# EAGLE design PhD_HAT (EAGLE 9.5.0)

## Sheet 1 of 2
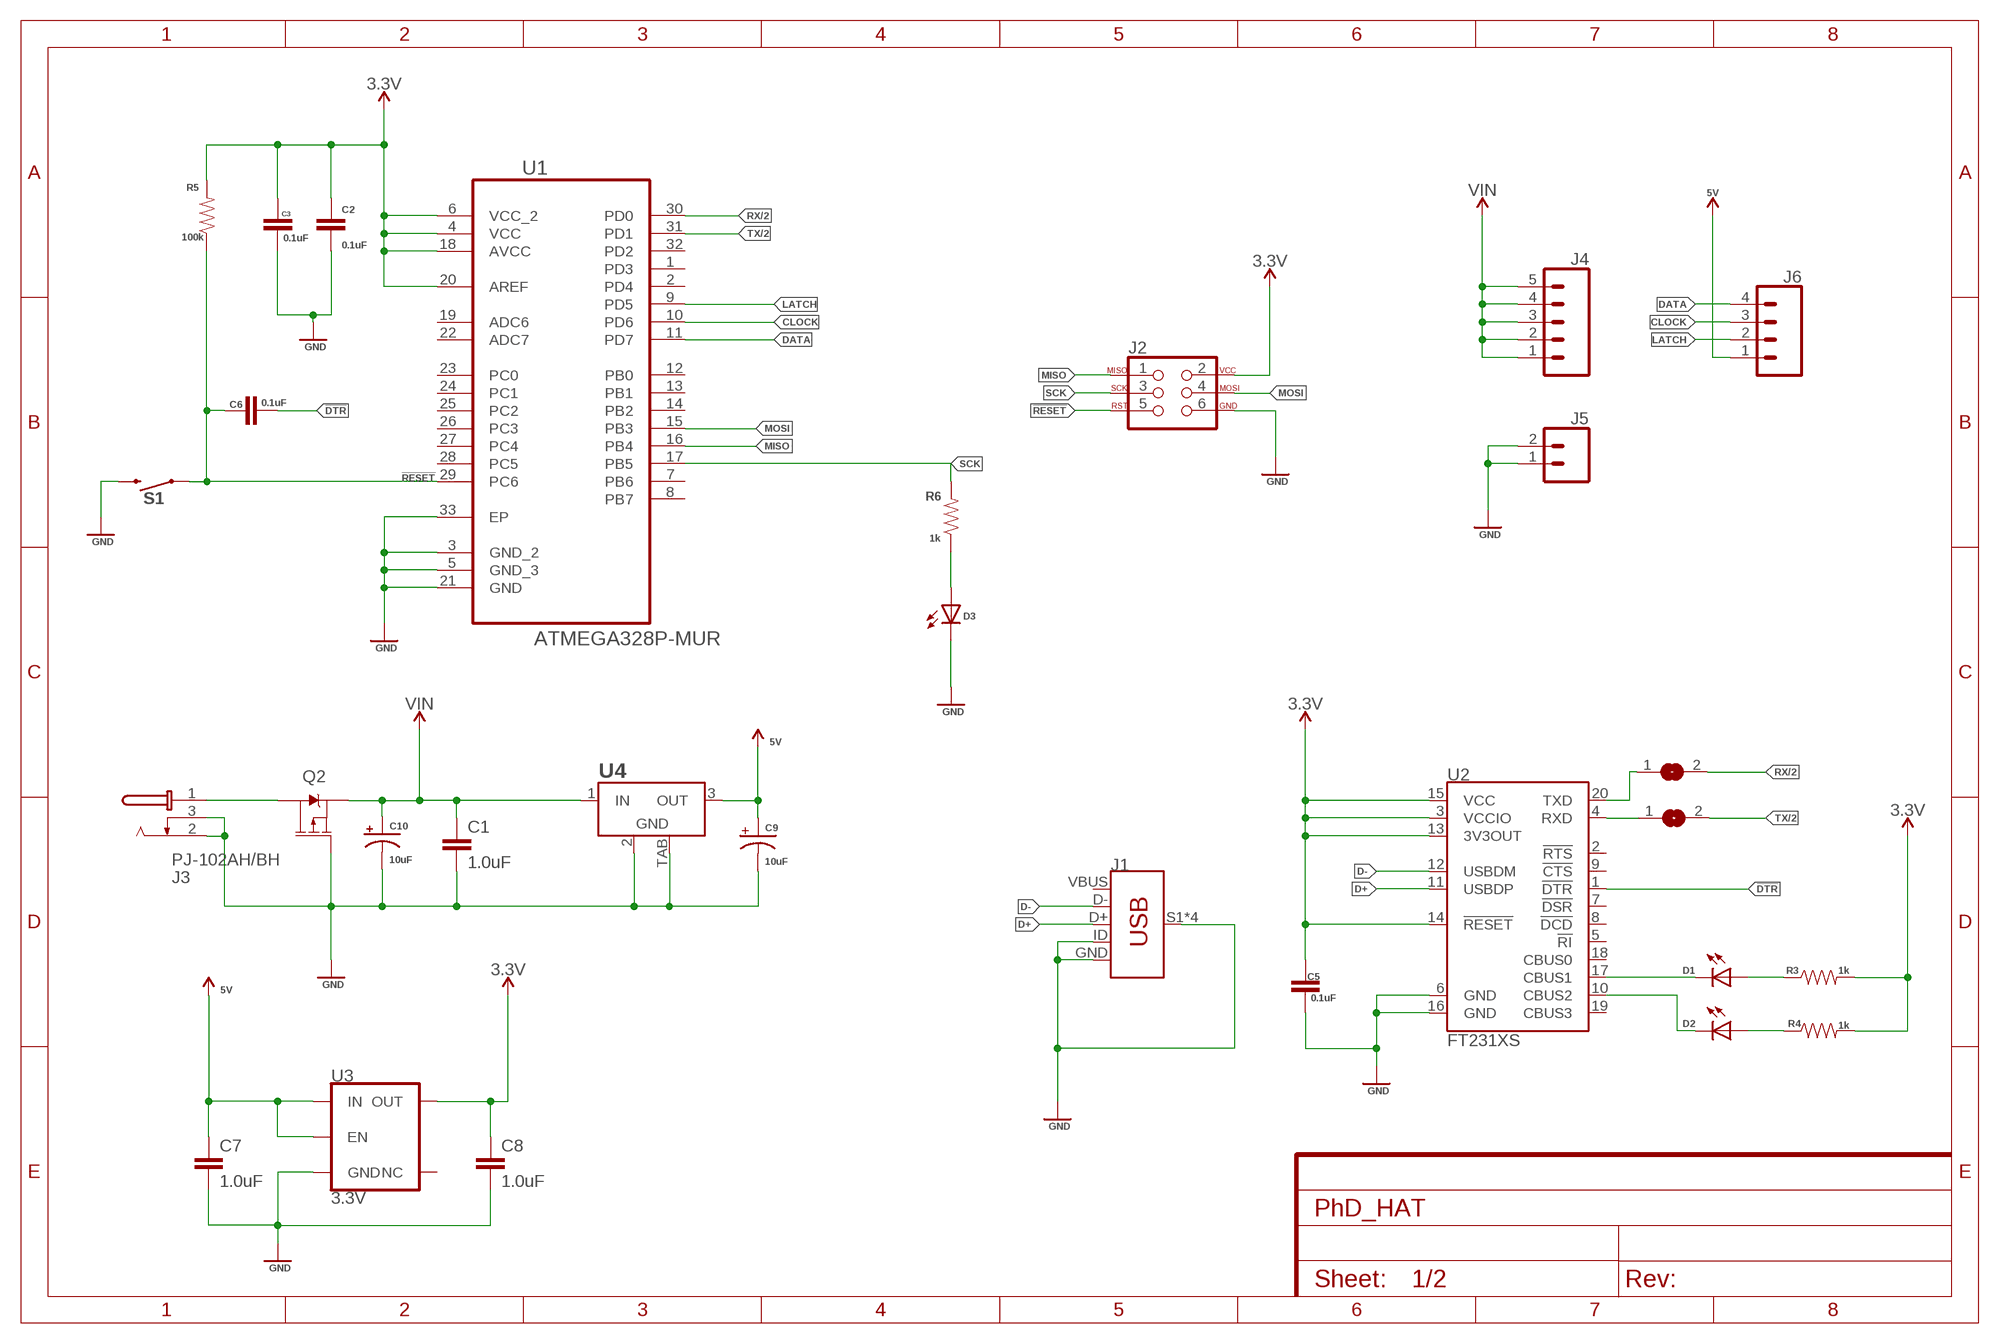
[diagram p0: schematic, sheet 1]

### Parts
C1  1.0uF  1.0UF-0603-16V-10%  [0603]
C2  0.1uF  0.1UF-0603-25V-(+80/-20%)  [0603]
C3  0.1uF  0.1UF-0603-25V-(+80/-20%)  [0603]
C5  0.1uF  0.1UF-0603-25V-(+80/-20%)  [0603]
C6  0.1uF  0.1UF-0603-25V-(+80/-20%)  [0603]
C7  1.0uF  1.0UF-0603-16V-10%  [0603]
C8  1.0uF  1.0UF-0603-16V-10%  [0603]
C9  10uF  10UF-POLAR-EIA3216-16V-10%(TANT)  [EIA3216]
C10  10uF  10UF-POLAR-EIA3216-16V-10%(TANT)  [EIA3216]
D1  LEDCHIP-LED0603  [CHIP-LED0603]
D2  LEDCHIP-LED0603  [CHIP-LED0603]
D3  LEDCHIP-LED0603  [CHIP-LED0603]
J1  USB_MINI-B_SMT  [USB-MINIB]
J2  AVR_SPI_PROG_3X2PTH  [2X3]
J3  PJ-102AH/BH  [PJ-102XH]
J4  CONN_05SCREW  [SCREWTERMINAL-3.5MM-5]
J5  CONN_023.5MM  [SCREWTERMINAL-3.5MM-2]
J6  CONN_04SCREW  [SCREWTERMINAL-3.5MM-4]
Q2  2.5A/30V/105mΩ  MOSFET_PCH-DMG2307L  [SOT23-3]
R3  1k  1KOHM-0603-1/10W-1%  [0603]
R4  1k  1KOHM-0603-1/10W-1%  [0603]
R5  100k  100KOHM-0603-1/10W-1%  [0603]
R6  1k  1KOHM-0603-1/10W-1%  [0603]
S1  MOMENTARY-SWITCH-SPST-PTH-6.0MM  [TACTILE_SWITCH_PTH_6.0MM]
SJ1  MICROBUILDER_SOLDERJUMPERREFLOW  [MICROBUILDER_SOLDERJUMPER_REFLOW]
SJ2  MICROBUILDER_SOLDERJUMPERREFLOW  [MICROBUILDER_SOLDERJUMPER_REFLOW]
U1  ATMEGA328P-MUR  [QFN50P500X500X100-33N]
U2  FT231XS  [SSOP20_L]
U3  3.3V  V_REG_AP2112K-3.3V  [SOT23-5]
U4  MIC39100-5.0WS  [SOT223]

### Nets
3.3V: C2.1 C3.1 C5.1 C8.1 J2.2 R3.2 R4.2 R5.2 U1.4(VCC) U1.6(VCC_2) U1.18(AVCC) U1.20(AREF) U2.3(VCCIO) U2.13(3V3OUT) U2.14(!RESET) U2.15(VCC) U3.5(OUT)
5V: C7.1 C9.+ J6.1 U3.1(IN) U3.3(EN) U4.3(OUT)
!DTR: C6.2 U2.1(!DTR)
!RESET: C6.1 J2.5 R5.1 S1.1 U1.29(PC6)
CLOCK: J6.3 U1.10(PD6)
D+: J1.D+ U2.11(USBDP)
D-: J1.D- U2.12(USBDM)
DATA: J6.4 U1.11(PD7)
GND: C1.2 C2.2 C3.2 C5.2 C7.2 C8.2 C9.- C10.- D3.C J1.GND J1.ID J1.S1(SHIELD) J1.S2(SHIELD) J1.S3(SHIELD) J1.S4(SHIELD) J2.6 J3.2(S) J3.3(SS) J5.1 J5.2 Q2.1(G) S1.3 U1.3(GND_2) U1.5(GND_3) U1.21(GND) U1.33(EP) U2.6(GND) U2.16(GND) U3.2(GND) U4.2(GND) U4.TAB(GND) ; also sheet 2
LATCH: J6.2 U1.9(PD5)
MISO: J2.1 U1.16(PB4)
MOSI: J2.4 U1.15(PB3)
N$2: D1.C U2.17(CBUS1)
N$3: D2.C U2.10(CBUS2)
N$4: D1.A R3.1
N$5: D2.A R4.1
N$6: D3.A R6.1
N$7: SJ1.1 U2.4(RXD)
N$8: SJ2.1 U2.20(TXD)
N$9: J3.1(T) Q2.3(D)
RX: SJ2.2 U1.30(PD0) ; also sheet 2
SCK: J2.3 R6.2 U1.17(PB5)
TX: SJ1.2 U1.31(PD1) ; also sheet 2
VIN: C1.1 C10.+ J4.1 J4.2 J4.3 J4.4 J4.5 Q2.2(S) U4.1(IN)
Unconnected: U1.1(PD3) U1.2(PD4) U1.7(PB6) U1.8(PB7) U1.12(PB0) U1.13(PB1) U1.14(PB2) U1.19(ADC6) U1.22(ADC7) U1.23(PC0) U1.24(PC1) U1.25(PC2) U1.26(PC3) U1.27(PC4) U1.28(PC5) U1.32(PD2) U2.2(!RTS) U2.5(!RI) U2.7(!DSR) U2.8(!DCD) U2.9(!CTS) U2.18(CBUS0) U2.19(CBUS3) U3.4(NC)

## Sheet 2 of 2
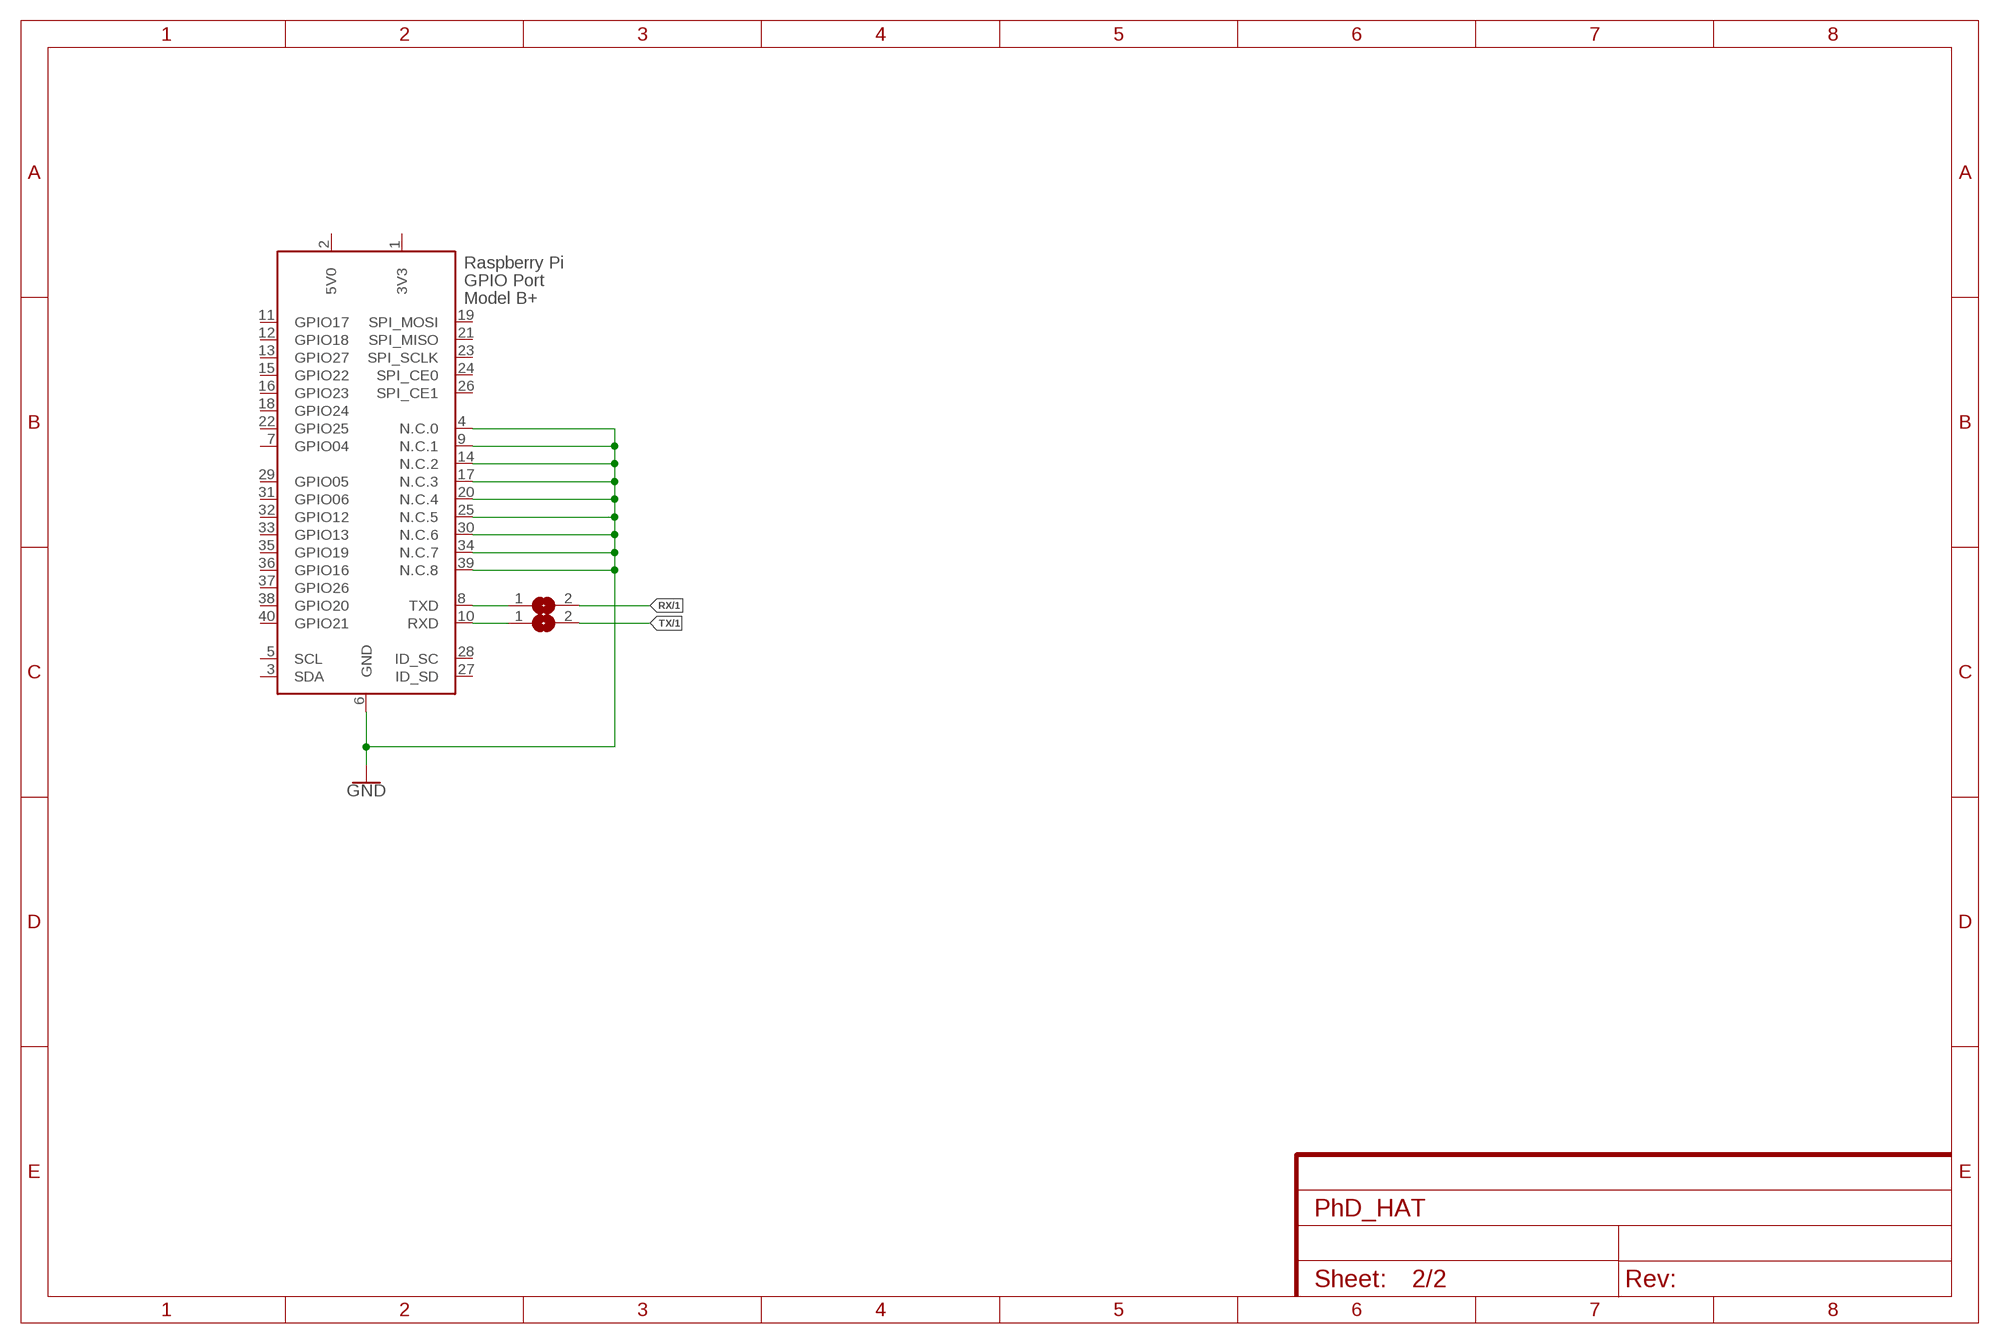
[diagram p1: schematic, sheet 2]

### Parts
SJ3  MICROBUILDER_SOLDERJUMPER  [MICROBUILDER_SOLDERJUMPER_ARROW_NOPASTE]
SJ4  MICROBUILDER_SOLDERJUMPER  [MICROBUILDER_SOLDERJUMPER_ARROW_NOPASTE]
X1  RASPI_BOARD_B+_H  [RASPI_BOARD_B+HAT]

### Nets
GND: X1.4(N.C.0) X1.6(GND) X1.9(N.C.1) X1.14(N.C.2) X1.17(N.C.3) X1.20(N.C.4) X1.25(N.C.5) X1.30(N.C.6) X1.34(N.C.7) X1.39(N.C.8) ; also sheet 1
N$11: SJ3.1 X1.8(TXD)
N$12: SJ4.1 X1.10(RXD)
RX: SJ3.2 ; also sheet 1
TX: SJ4.2 ; also sheet 1
Unconnected: X1.3(SDA) X1.5(SCL) X1.7(GPIO04) X1.11(GPIO17) X1.12(GPIO18) X1.13(GPIO27) X1.15(GPIO22) X1.16(GPIO23) X1.18(GPIO24) X1.19(SPI_MOSI) X1.21(SPI_MISO) X1.22(GPIO25) X1.23(SPI_SCLK) X1.24(SPI_CE0) X1.26(SPI_CE1) X1.27(ID_SD) X1.28(ID_SC) X1.29(GPIO05) X1.31(GPIO06) X1.32(GPIO12) X1.33(GPIO13) X1.35(GPIO19) X1.36(GPIO16) X1.37(GPIO26) X1.38(GPIO20) X1.40(GPIO21)

## Power pins joined to a net without a drawn wire
3V3: X1.1(3V3)
5V0: X1.2(5V0)
VBUS: J1.VBUS

## Library data of the parts
C1 C7 C8 = SparkFun-Capacitors:1.0UF: 1µF ceramic capacitors A capacitor is a passive two-terminal electrical component used to store electrical energy temporarily in an electric field.; PROD_ID: CAP-00868
C2 C3 C5 C6 = SparkFun-Capacitors:0.1UF: 0.1µF ceramic capacitors A capacitor is a passive two-terminal electrical component used to store electrical energy temporarily in an electric field.; PROD_ID: CAP-00810
C9 C10 = SparkFun-Capacitors:10UF-POLAR: 10.0µF polarized capacitors A capacitor is a passive two-terminal electrical component used to store electrical energy temporarily in an electric field.; PROD_ID: CAP-00811
D1-D3 = adafruit:LED: LED OSRAM: - CHIPLED LG R971, LG N971, LY N971, LG Q971, LY Q971, LO R971, LY R971 LH N974, LH R974 LS Q976, LO Q976, LY Q976 LO Q996 - Hyper CHIPLED LW Q18S LB Q993, LB Q99A, LB R99A - SideLED LS A670, LO A670, LY A670, LG A670, LP A670 LB A673, LV A673, LT A673, LW A673 LH A674 LY A675 LS A676, LA A676, LO A676, LY A676, LW A676 LS A679, LY A679, LG A679 - Hyper Micro SIDELED® LS Y876, LA Y876, LO Y876, LY Y876 LT Y87S - SmartLED LW L88C, LW L88S LB L89C, LB L89S, LG L890 LS L89K, LO L89K, LY L89K LS L896, LA L896, LO L896, LY L896 - TOPLED LS T670, LO T670, LY T670, LG T670, LP T670 LSG T670, LSP T670, LSY T670, LOP T670, LYG T670 LG T671, LOG T671, LSG T671 LB T673, LV T673, LT T673, LW T673 LH T674 LS T676, LA T676, LO T676, LY T676, LB T676, LH T676, LSB T676, LW T676 LB T67C, LV T67C, LT T67C, LS T67K, LO T67K, LY T67K, LW E67C LS E67B, LA E67B, LO E67B, LY E67B, LB E67C, LV E67C, LT E67C LW T67C LS T679, LY T679, LG T679 LS T770, LO T770, LY T770, LG T770, LP T770 LB T773, LV T773, LT T773, LW T773 LH T774 LS E675, LA E675, LY E675, LS T675 LS T776, LA T776, LO T776, LY T776, LB T776 LHGB T686 LT T68C, LB T68C - Hyper Mini TOPLED® LB M676 - Mini TOPLED Santana® LG M470 LS M47K, LO M47K, LY M47K Source: http://www.osram.convergy.de/
J1 = SparkFun-Connectors:USB_MINI-B: USB type Mini-B Connector Breaks out 5th pin, and includes shield pins if needed. SparkFun Products: SparkFun FTDI Basic Breakout <https://www.sparkfun.com/products/9716> SparkFun XBee Explorer USB <https://www.sparkfun.com/products/11812> SparkFun Redboard <https://www.sparkfun.com/products/12757>; PROD_ID: CONN-08193; SF_ID: PRT-00587
J2 = SparkFun-Connectors:AVR_SPI_PROG_3X2: AVR ISP 6 Pin This is the reduced ISP connector for AVR programming. Common on Arduino. This footprint will take up less PCB space and can be used with a 10-pin to 6-pin adapter such as SKU: BOB-08508 **Special note about "TEST_POINT" package. The stop mask is on the top side, so if you want your programming test points to be on the bottom of your board, make sure to place this package on the bottom side of the board. This also ensure that the orientation to program from the bottom side will be correct. SparkFun Products: SparkFun ISP Pogo Adapter <https://www.sparkfun.com/products/11591> - NS Tiny AVR Programmer <https://www.sparkfun.com/products/11801> -PTH
J3 = con-cuistack:PJ-102AH/BH: DC Power Jack PJ-102AH (2.1 x 5.5 MM) PJ-102BH (2.5 x 5.5 MM)
J4 = SparkFun-Connectors:CONN_05: Multi connection point. Often used as Generic Header-pin footprint for 0.1 inch spaced/style header connections On any of the 0.1 inch spaced packages, you can populate with these: Break Away Headers - Straight <https://www.sparkfun.com/products/116> (PRT-00116) Break Away Male Headers - Right Angle <https://www.sparkfun.com/products/553> (PRT-00553) Female Headers <https://www.sparkfun.com/products/115> (PRT-00115) Break Away Headers - Machine Pin <https://www.sparkfun.com/products/117> (PRT-00117) Break Away Female Headers - Swiss Machine Pin <https://www.sparkfun.com/products/743> (PRT-00743) For SCREWTERMINALS and SPRING TERMINALS visit here: Screw Terimnals on SparkFun.com <https://www.sparkfun.com/search/results?term=Screw+Terminals> (5mm/3.5mm/2.54mm spacing) This device is also useful as a general connection point to wire up your design to another part of your project. Our various solder wires solder well into these plated through hole pads. Hook-Up Wire - Assortment (Stranded, 22 AWG) <https://www.sparkfun.com/products/11375> (PRT-11375) Hook-Up Wire - Assortment (Solid Core, 22 AWG) <https://www.sparkfun.com/products/11367> (PRT-11367) View the entire wire category on our website here <https://www.sparkfun.com/categories/141> Special notes: Molex polarized connector foot print use with SKU : PRT-08231 with associated crimp pins and housings. 1MM SMD Version SKU: PRT-10208; PROD_ID: Combine 8288+8399
J5 = SparkFun-Connectors:CONN_02: Multi connection point. Often used as Generic Header-pin footprint for 0.1 inch spaced/style header connections On any of the 0.1 inch spaced packages, you can populate with these: Break Away Headers - Straight <https://www.sparkfun.com/products/116> (PRT-00116) Break Away Male Headers - Right Angle <https://www.sparkfun.com/products/553> (PRT-00553) Female Headers <https://www.sparkfun.com/products/115> (PRT-00115) Break Away Headers - Machine Pin <https://www.sparkfun.com/products/117> (PRT-00117) Break Away Female Headers - Swiss Machine Pin <https://www.sparkfun.com/products/743> (PRT-00743) For SCREWTERMINALS and SPRING TERMINALS visit here: Screw Terimnals on SparkFun.com <https://www.sparkfun.com/search/results?term=Screw+Terminals> (5mm/3.5mm/2.54mm spacing) This device is also useful as a general connection point to wire up your design to another part of your project. Our various solder wires solder well into these plated through hole pads. Hook-Up Wire - Assortment (Stranded, 22 AWG) <https://www.sparkfun.com/products/11375> (PRT-11375) Hook-Up Wire - Assortment (Solid Core, 22 AWG) <https://www.sparkfun.com/products/11367> (PRT-11367) View the entire wire category on our website here <https://www.sparkfun.com/categories/141> Special notes: Molex polarized connector foot print use with: PRT-08233 with associated crimp pins and housings. 2.54_SCREWTERM for use with PRT-10571. 3.5mm Screw Terminal footprints for PRT-08084 5mm Screw Terminal footprints for use with PRT-08432; PROD_ID: CONN-08399
J6 = SparkFun-Connectors:CONN_04: Multi connection point. Often used as Generic Header-pin footprint for 0.1 inch spaced/style header connections On any of the 0.1 inch spaced packages, you can populate with these: Break Away Headers - Straight <https://www.sparkfun.com/products/116> (PRT-00116) Break Away Male Headers - Right Angle <https://www.sparkfun.com/products/553> (PRT-00553) Female Headers <https://www.sparkfun.com/products/115> (PRT-00115) Break Away Headers - Machine Pin <https://www.sparkfun.com/products/117> (PRT-00117) Break Away Female Headers - Swiss Machine Pin <https://www.sparkfun.com/products/743> (PRT-00743) For SCREWTERMINALS and SPRING TERMINALS visit here: Screw Terimnals on SparkFun.com <https://www.sparkfun.com/search/results?term=Screw+Terminals> (5mm/3.5mm/2.54mm spacing) This device is also useful as a general connection point to wire up your design to another part of your project. Our various solder wires solder well into these plated through hole pads. Hook-Up Wire - Assortment (Stranded, 22 AWG) <https://www.sparkfun.com/products/11375> (PRT-11375) Hook-Up Wire - Assortment (Solid Core, 22 AWG) <https://www.sparkfun.com/products/11367> (PRT-11367) View the entire wire category on our website here <https://www.sparkfun.com/categories/141> Special notes: Molex polarized connector foot print use with SKU : PRT-08231 with associated crimp pins and housings. 1MM SMD Version SKU: PRT-10208; PROD_ID: 2xCONN-08399; SF_ID: 2xPRT-08084
Q2 = SparkFun-DiscreteSemi:MOSFET_PCH: P-channel MOSFETs Voltage controlled devices that allow control of high current outputs. SparkFun Products: SparkFun ESP32 Thing <https://www.sparkfun.com/products/13907> SparkFun ESP8266 Thing <https://www.sparkfun.com/products/13231>; PROD_ID: TRANS-11308
R3 R4 R6 = SparkFun-Resistors:1KOHM: 1kΩ resistor A resistor is a passive two-terminal electrical component that implements electrical resistance as a circuit element. Resistors act to reduce current flow, and, at the same time, act to lower voltage levels within circuits. - Wikipedia; PROD_ID: RES-07856
R5 = SparkFun-Resistors:100KOHM: 100kΩ resistor A resistor is a passive two-terminal electrical component that implements electrical resistance as a circuit element. Resistors act to reduce current flow, and, at the same time, act to lower voltage levels within circuits. - Wikipedia; PROD_ID: RES-07828
S1 = SparkFun-Switches:MOMENTARY-SWITCH-SPST: Momentary Switch (Pushbutton) - SPST Normally-open (NO) SPST momentary switches (buttons, pushbuttons). Variants PTH-12MM - 12mm square, through-hole Momentary Pushbutton Switch - 12mm Square <https://www.sparkfun.com/products/9190> (COM-09190) PTH-6.0MM, PTH-6.0MM-KIT - 6.0mm square, through-hole Mini Pushbutton Switch <https://www.sparkfun.com/products/97> (COM-00097) KIT package intended for soldering kit's - only one side of pads' copper is exposed. PTH-RIGHT-ANGLE-KIT - Right-angle, through-hole Right Angle Tactile Button <https://www.sparkfun.com/products/10791> - Used on SparkFun BigTime Watch Kit <https://www.sparkfun.com/products/11734> SMD-12MM - 12mm square, surface-mount Tactile Button - SMD (12mm) <https://www.sparkfun.com/products/12993> (COM-12993) Used on SparkFun PicoBoard <https://www.sparkfun.com/products/11888> SMD-4.5MM - 4.5mm Square Trackball Switch Used on SparkFun Blackberry Trackballer Breakout <https://www.sparkfun.com/products/13169> SMD-4.6MMX2.8MM - 4.60mm x 2.80mm, surface mount Used on SparkFun SAMD21 Mini Breakout <https://www.sparkfun.com/products/13664> SMD-5.2MM, SMD-5.2-REDUNDANT - 5.2mm square, surface-mount Mini Pushbutton Switch - SMD <https://www.sparkfun.com/products/8720> (COM-08720) Used on Arduino Pro Mini <https://www.sparkfun.com/products/11114> REDUNDANT package connects both switch circuits together SMD-6.0X3.5MM - 6.0 x 3.5mm, surface mount Momentary Reset Switch SMD <https://www.sparkfun.com/products/8229> (COM-08229) SMD-6.2MM-TALL - 6.2mm square, surface mount Tactile Button - SMD (6mm) <https://www.sparkfun.com/products/12992> Used on SparkFun Digital Sandbox <https://www.sparkfun.com/products/12651> SMD-RIGHT-ANGLE - Right-angle, surface mount Used on SparkFun Block for Intel® Edison - Arduino <https://www.sparkfun.com/products/13036>; PROD_ID: SWCH-08441; SF_SKU: COM-00097
SJ1 SJ2 = Adafruit Crickit FeatherWing:MICROBUILDER_SOLDERJUMPER: SMD Solder JUMPER Solder the two pads together to create a connection, or remove the solder to break it. REFLOW - Use this footprint for solder paste and reflow ovens. WAVE - Use this footprint for hand-soldering (larger pads). CLOSED - Has a trace between the two pads to ensure it is closed by default. The trace needs to be cut to disable the jumper, and can be closed again by creating a solder bridge between the two pads.
SJ3 SJ4 = Adafruit Crickit FeatherWing:MICROBUILDER_SOLDERJUMPER: SMD Solder JUMPER Solder the two pads together to create a connection, or remove the solder to break it. REFLOW - Use this footprint for solder paste and reflow ovens. WAVE - Use this footprint for hand-soldering (larger pads). CLOSED - Has a trace between the two pads to ensure it is closed by default. The trace needs to be cut to disable the jumper, and can be closed again by creating a solder bridge between the two pads.; BOM: EXCLUDE
U1 = ATMEGA328P-MUR:ATMEGA328P-MUR: Programmable Flash; AVAILABILITY: Unavailable; DESCRIPTION: Embedded microcontroller ATMEGA328P-MUR VQFN 32 _5x5_ Microchip Technology 8-Bit 20 MHz I/O number 23; MF: Microchip; MP: ATMEGA328P-MUR; PACKAGE: VQFN-32 Microchip; PRICE: None
U2 = SparkFun-IC-Comms:FT231X: FTDI FT231X Full Speed USB to Full-handshake UART This USB2.0 Full Speed IC offers a compact bridge to full handshake UART interfaces. The device is a UART, capable of operating up to 3MBaud, with low power consumption (8mA). The FT231X includes the complete FT-X series feature set and enables USB to be added into a system design quickly and easily over a UART interface. Datasheet <http://cdn.sparkfun.com/datasheets/Components/General%20IC/DS_FT231X.pdf> SparkFun Products SparkFun RedBoard - Programmed with Arduino <https://www.sparkfun.com/products/12757> (DEV-12757) SparkFun XBee Explorer USB <https://www.sparkfun.com/products/11812> (WRL-11812) SparkFun XBee Explorer Dongle <https://www.sparkfun.com/products/11697> (WRL-11697) SparkFun Blynk Board - ESP8266 <https://www.sparkfun.com/products/13794> (WRL-13794) SparkFun ESP8266 Thing - Dev Board <https://www.sparkfun.com/products/13711> (WRL-13711) SparkFun Block for Intel® Edison - Base <https://www.sparkfun.com/products/13045> (DEV-13045) SparkFun RedStick <https://www.sparkfun.com/products/13741> (DEV-13741) SparkFun Beefy 3 - FTDI Basic Breakout <https://www.sparkfun.com/products/13746> (DEV-13746) SparkFun FT231X Breakout <https://www.sparkfun.com/products/11736> (BOB-11736); PROD_ID: IC-11524
U3 = SparkFun-IC-Power:V_REG_AP2112: AP2112 - 600mA CMOS LDO Regulator w/ Enable The AP2112 is CMOS process low dropout linear regulator with enable function, the regulator delivers a guaranteed 600mA (min.) continuous load current. Features Output Voltage Accuracy: ±1.5% Output Current: 600mA (Min.) Foldback Short Current Protection: 50mA Enable Function to Turn ON/OFF VOUT Low Dropout Voltage (3.3V): 250mV (Typ.) @IOUT=600mA Excellent Load Regulation: 0.2%/A (Typ.) Excellent Line Regulation: 0.02%/V (Typ.) Low Quiescent Current: 55μA (Typ.) Low Standby Current: 0.01μA (Typ.) Low Output Noise: 50μVRMS PSRR: 100Hz -65dB, 1kHz -65dB OTSD Protection Stable with 1.0μF Flexible Cap: Ceramic, Tantalum and Aluminum Electrolytic Operation Temperature Range: -40°C to 85°C ESD: MM 400V, HBM 4000V; PROD_ID: VREG-12457
U4 = MIC39100-5.0WS:MIC39100-5.0WS; AVAILABILITY: Unavailable; DESCRIPTION: LDO Regulator Pos 5V 1A; MF: Micrel; MP: MIC39100-5.0WS; PACKAGE: SOT-223 Micrel; PRICE: None
X1 = raspberrypi_bastelstube_v13:RASPI_BOARD_B+: Raspberry Pi GPIO connector with markings for the outer dimensions of the Raspberry Pi board model B+ with different sets of drill holes or mounting pads

## Board
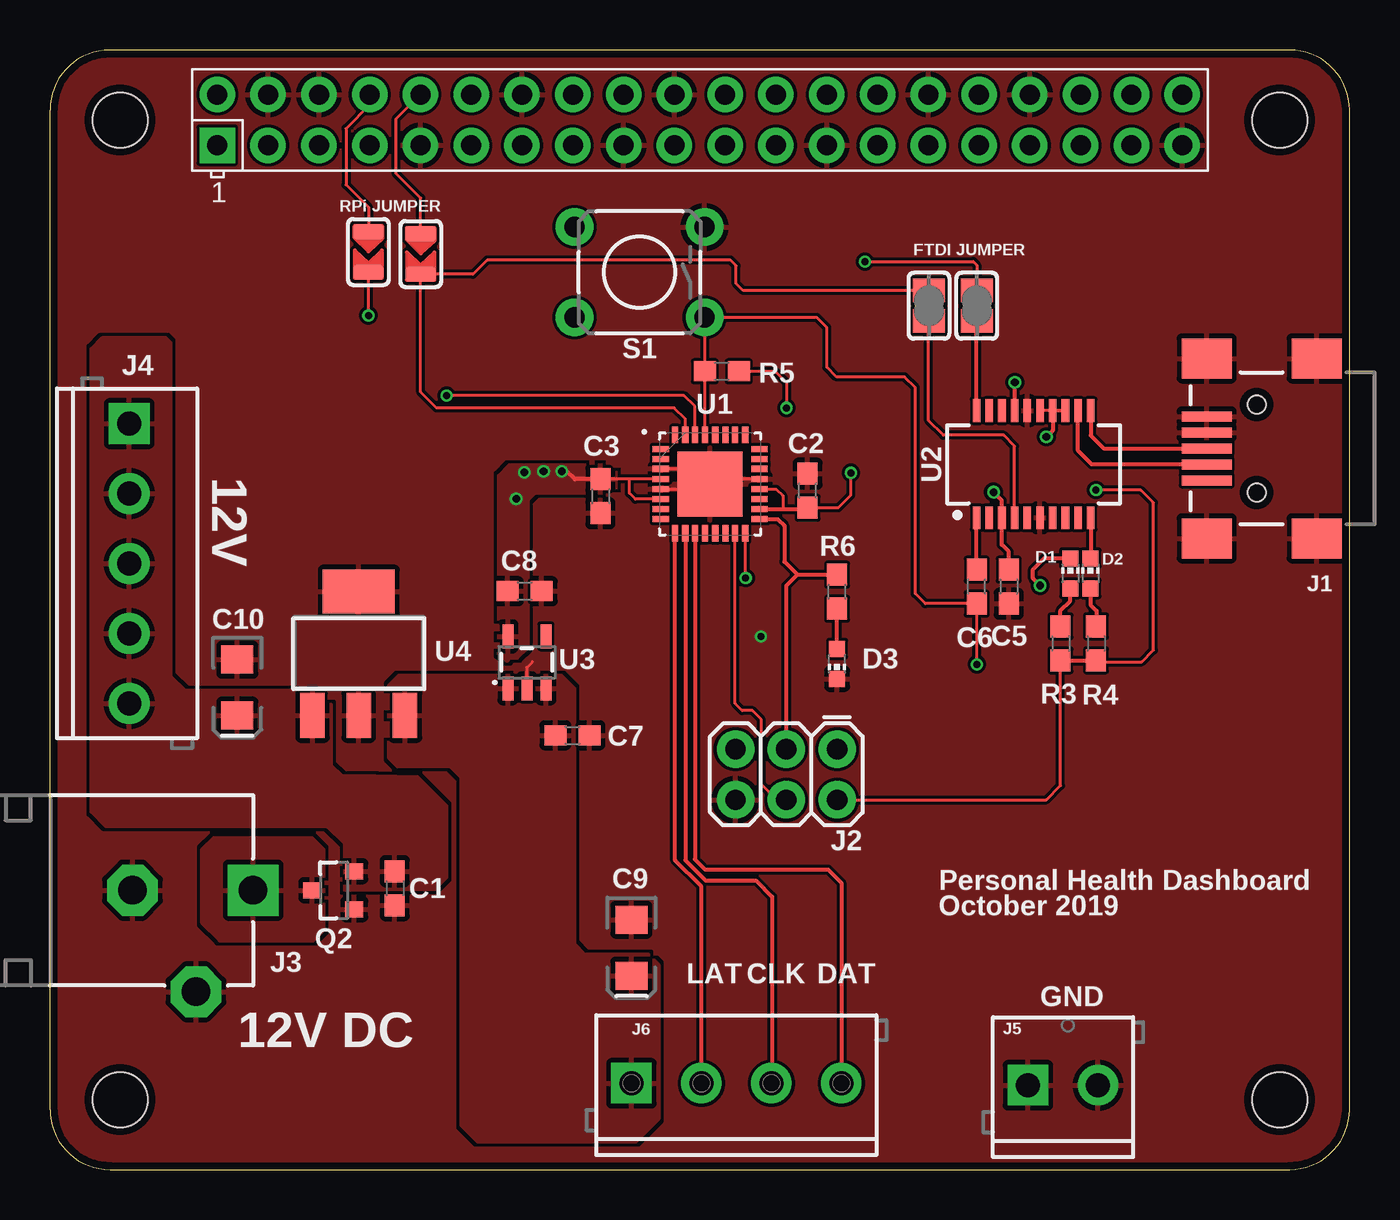
[diagram p2: board, top side]
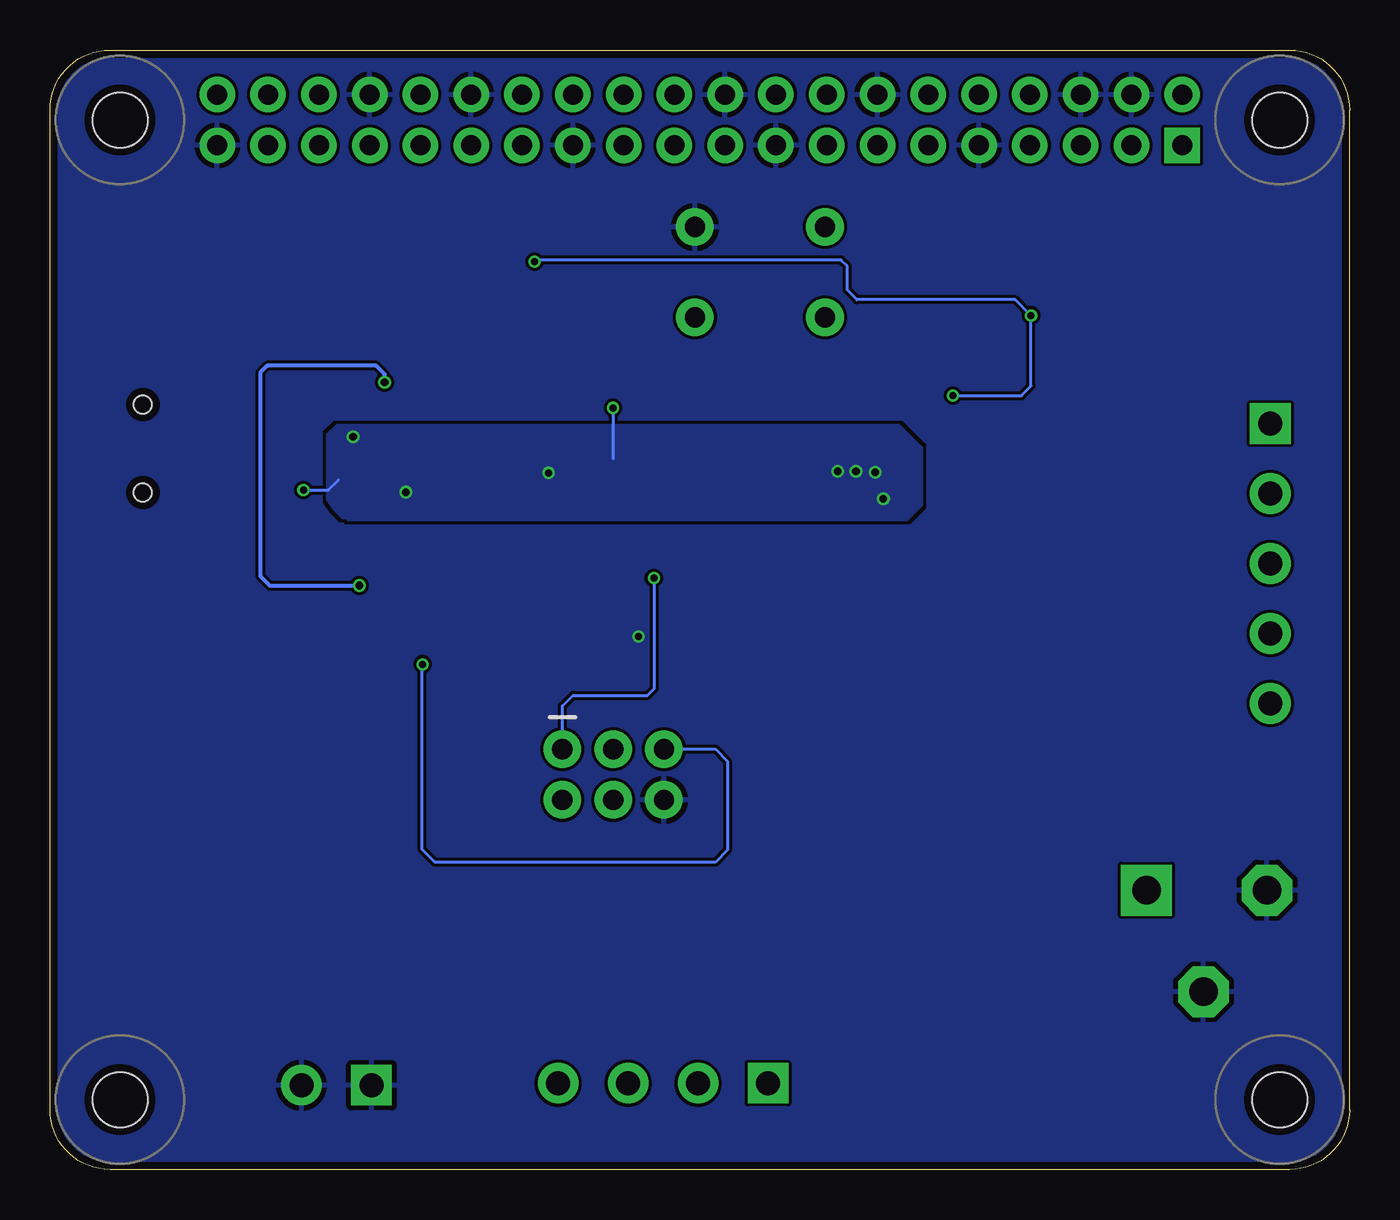
[diagram p3: board, bottom side, seen from below]

Size 65 x 56 mm. Coordinates in mm from the lower left corner, seen from the top.
Copper layers (1*16): Top 0.035559375mm / dielectric 1.6mm / Bottom 0.035559375mm
Design rules "oshpark-2layer": minimum track width 6mil, minimum drill 10mil, track to track 6mil, track to pad 6mil, pad to pad 6mil, via to via 6mil, smd to smd 6mil, copper to edge 15mil, drill to drill 6mil, minimum pad ring 5mil, minimum via ring 5mil, stop-mask expansion 2.5mil, vias tented up to drill 0mil, thermal gap 10mil

### Footprints (pad centres in the part's own frame; a part is rotated, then mirrored left to right if it is on the bottom)
0603 = smd 1.1 x 1: 1 -0.85,0; 2 0.85,0
EIA3216 = smd 1.4 x 1.6: + 1.4,0; - -1.4,0
CHIP-LED0603 = smd 0.8 x 0.8: A 0,-0.75; C 0,0.75
USB-MINIB = smd 2.5 x 0.5: D+ 2.5,0; D- 2.5,0.8; GND 2.5,-1.6; ID 2.5,-0.8; VBUS 2.5,1.6 | smd 2.5 x 2: S1 -3,4.5; S2 2.5,4.5; S3 -3,-4.5; S4 2.5,-4.5 | hole 0.9: 0,2.2; 0,-2.2
2X3 = drill 1.016 pad 1.88: 1 0,0; 2 0,2.54; 3 2.54,0; 4 2.54,2.54; 5 5.08,0; 6 5.08,2.54
PJ-102XH = drill 1.422 pad 2.54 square: 1 0,0 | drill 1.422 pad 2.54 octagon: 2 0,-6.032; 3 5.08,-2.857
SCREWTERMINAL-3.5MM-5 = drill 1.2 pad 2.032 square: 1 0,0 | drill 1.2 pad 2.032: 2 3.5,0; 3 7,0; 4 10.5,0; 5 14,0
SCREWTERMINAL-3.5MM-2 = drill 1.2 pad 2.032 square: 1 0,0 | drill 1.2 pad 2.032: 2 3.5,0
SCREWTERMINAL-3.5MM-4 = drill 1.2 pad 2.032 square: 1 0,0 | drill 1.2 pad 2.032: 2 3.5,0; 3 7,0; 4 10.5,0
SOT23-3 = smd 0.8 x 0.9: 1 -0.95,-1; 2 0.95,-1; 3 0,1.1
TACTILE_SWITCH_PTH_6.0MM = drill 1.016 pad 1.88: 1 -3.251,2.261; 2 3.251,2.261; 3 -3.251,-2.261; 4 3.251,-2.261
MICROBUILDER_SOLDERJUMPER_REFLOW = smd 1.168 x 1.6: 1 -0.762,0; 2 0.762,0
MICROBUILDER_SOLDERJUMPER_ARROW_NOPASTE = smd 0.762 x 1.524: 1 -1.016,0; 2 1.016,0
QFN50P500X500X100-33N = smd 0.813 x 0.305: 1 -2.464,1.753; 2 -2.464,1.245; 3 -2.464,0.762; 4 -2.464,0.254; 5 -2.464,-0.254; 6 -2.464,-0.762; 7 -2.464,-1.245; 8 -2.464,-1.753; 17 2.464,-1.753; 18 2.464,-1.245; 19 2.464,-0.762; 20 2.464,-0.254; 21 2.464,0.254; 22 2.464,0.762; 23 2.464,1.245; 24 2.464,1.753 | smd 0.305 x 0.813: 9 -1.753,-2.464; 10 -1.245,-2.464; 11 -0.762,-2.464; 12 -0.254,-2.464; 13 0.254,-2.464; 14 0.762,-2.464; 15 1.245,-2.464; 16 1.753,-2.464; 25 1.753,2.464; 26 1.245,2.464; 27 0.762,2.464; 28 0.254,2.464; 29 -0.254,2.464; 30 -0.762,2.464; 31 -1.245,2.464; 32 -1.753,2.464 | smd 3.251 x 3.251: 33 0,0
SSOP20_L = smd 0.381 x 1.143: 1 -2.857,-2.68; 2 -2.223,-2.68; 3 -1.587,-2.68; 4 -0.953,-2.68; 5 -0.318,-2.68; 6 0.318,-2.68; 7 0.953,-2.68; 8 1.587,-2.68; 9 2.223,-2.68; 10 2.857,-2.68; 11 2.857,2.68; 12 2.223,2.68; 13 1.587,2.68; 14 0.953,2.68; 15 0.318,2.68; 16 -0.318,2.68; 17 -0.953,2.68; 18 -1.587,2.68; 19 -2.223,2.68; 20 -2.857,2.68
SOT23-5 = smd 0.55 x 1.2: 1 -0.95,-1.3; 2 0,-1.3; 3 0.95,-1.3; 4 0.95,1.3; 5 -0.95,1.3
SOT223 = smd 1.219 x 2.235: 1 -2.311,-3.099; 2 0,-3.099; 3 2.311,-3.099 | smd 3.6 x 2.2: TAB 0,3.099
RASPI_BOARD_B+HAT = drill 1 pad 1.778 square: 1 8.37,51.23 | drill 1 pad 1.778: 2 8.37,53.77; 3 10.91,51.23; 4 10.91,53.77; 5 13.45,51.23; 6 13.45,53.77; 7 15.99,51.23; 8 15.99,53.77; 9 18.53,51.23; 10 18.53,53.77; 11 21.07,51.23; 12 21.07,53.77; 13 23.61,51.23; 14 23.61,53.77; 15 26.15,51.23; 16 26.15,53.77; 17 28.69,51.23; 18 28.69,53.77; 19 31.23,51.23; 20 31.23,53.77; 21 33.77,51.23; 22 33.77,53.77; 23 36.31,51.23; 24 36.31,53.77; 25 38.85,51.23; 26 38.85,53.77; 27 41.39,51.23; 28 41.39,53.77; 29 43.93,51.23; 30 43.93,53.77; 31 46.47,51.23; 32 46.47,53.77; 33 49.01,51.23; 34 49.01,53.77; 35 51.55,51.23; 36 51.55,53.77; 37 54.09,51.23; 38 54.09,53.77; 39 56.63,51.23; 40 56.63,53.77 | hole 2.75: 3.5,3.5; 3.5,52.5; 61.5,3.5; 61.5,52.5

### Placement (x,y rotation side)
C1  17.25,14.07 270 top
C2  37.9,33.96 90 top
C3  27.53,33.68 270 top
C5  47.96,29.16 270 top
C6  46.35,29.16 90 top
C7  26.14,21.72 0 top
C8  23.75,28.93 0 top
C9  29.08,11.1 270 top
C10  9.37,24.1 270 top
D1  51.03,29.82 0 top
D2  52.04,29.82 0 top
D3  39.37,25.3 180 top
J1  60.35,36.07 180 top
J2  39.37,21.03 180 top
J3  10.16,13.97 270 top
J4  3.96,37.31 270 top
J5  48.92,4.22 0 top
J6  29.08,4.32 0 top
Q2  14.22,13.97 90 top
R3  50.55,26.31 270 top
R4  52.32,26.31 270 top
R5  33.6,39.93 0 top
R6  39.37,28.91 90 top
S1  29.49,44.88 180 top
SJ1  43.97,43.21 90 top
SJ2  46.35,43.21 90 top
SJ3  15.93,45.9 270 top
SJ4  18.54,45.8 270 top
U1  33.02,34.29 0 top
U2  49.2,35.28 0 top
U3  23.85,25.37 0 top
U4  15.44,25.81 0 top
X1  0,0 0 top

### Tracks (layer width: path | path; a pad name or v marks a point on that pad's centre or on a via)
3.3V  (via drill 0.35, 0.38)
  Top 0.152: U1.4 30.54,34.53 28.98,34.53 | 28.98,34.53 C3.1 | U1.6 29.29,33.53 28.98,33.83 28.98,34.53 | R4.2 52.39,25.4 54.61,25.4 55.19,25.98 55.19,33.35 54.56,33.98 v52.32,33.98 | J2.2 49.84,18.49 50.55,19.2 R3.2 | U1.20 36.32,34.04 36.65,33.71 36.65,33.05 | R5.2 36.27,39.93 36.83,39.37 v36.83,38.1 | C2.1 39.43,33.11 40.06,33.73 v40.06,34.85 | U2.15 U2.13 U2.14
  Top 0.203: C3.1 26.25,34.53 25.86,34.92 | U1.18 36.65,33.05 37.83,33.05 C2.1 | U2.14 50.15,36.97 v49.84,36.65 | C5.1 47.95,30.91 47.61,31.25 U2.3 47.61,33.47 v47.19,33.88 | R3.2 R4.2
  Bottom 0.152: v52.32,33.98 51.08,33.98 50.57,34.49 | v36.83,38.1 36.83,35.56
  other vias: 25.6,34.92 24.69,34.92 23.72,34.87 23.32,33.55
  pour Top: 22.43,25.78 22.43,34.72 22.96,35.26 27.99,35.26 28.32,34.92 28.32,34.06 28.07,33.81 24.26,33.81 23.9,33.45 23.9,26.09 23.37,25.55 23.01,25.55 22.86,25.4
  pour Bottom: 51.1,33.48 51.1,36.78 50.65,37.24 22.53,37.24 21.41,36.12 21.41,33.22 22.15,32.49 50.06,32.49 50.16,32.59 50.37,32.59 50.8,33.02
5V
  pour Top: 30.48,2.54 30.48,10.24 29.95,10.77 26.77,10.77 26.26,11.28 26.26,24.05 25.6,24.71 17.42,24.71 17.09,24.38 16.92,24.21 16.92,20.85 16.92,20.6 17.35,20.17 19.05,20.17 19.99,20.17 20.55,19.61 20.55,2.21 21.36,1.4 29.34,1.4
!DTR
  Top 0.203: C6.2 46.34,30.02 U2.1
!RESET  (via drill 0.35)
  Top 0.152: U1.29 32.77,39.92 R5.1 32.75,42.61 S1.1 38.35,42.62 38.86,42.11 38.86,40.13 39.34,39.65 42.75,39.65 43.28,39.12 43.28,28.8 43.78,28.31 C6.1 v46.35,25.27
  Bottom 0.152: J2.5 31.73,21.03 31.11,20.42 31.11,15.98 31.73,15.37 45.74,15.37 46.38,16 46.38,25.25 v46.35,25.27
CLOCK
  Top 0.203: U1.10 31.77,15.47 32.79,14.45 35.31,14.45 36.12,13.64 36.12,4.35 J6.3
D+
  Top 0.203: U2.11 52.06,36.72 52.7,36.07 J1.D+
D-
  Top 0.203: J1.D- 52.11,35.27 51.42,35.95 U2.12
DATA
  Top 0.203: U1.11 32.26,15.52 32.77,15.01 38.91,15.01 39.58,14.34 J6.4
GND  (via drill 0.35)
  Top 0.152: U1.5 32.54,34.04 | 32.54,34.04 32.59,33.98 | U1.3 31.88,35.05 31.95,34.98 | U1.21 34.01,34.54 33.93,34.62 33.35,34.62 U1.33 32.77,34.04 32.54,34.04 | U3.2 23.85,25.12 24.13,25.4
  other vias: 35.56,26.67
  pour Top (rank 6): 0,0 65.02,0 65.02,54.61 65.02,55.93 58.55,55.93 0,55.93
  pour Bottom (rank 6): 0,0 65.02,0 65.02,55.91 0,55.91
LATCH
  Top 0.203: J6.2 32.58,14.16 31.27,15.47 U1.9
MISO  (via drill 0.35)
  Top 0.152: U1.16 34.77,29.62 v34.8,29.59
  Bottom 0.152: J2.1 39.37,23.19 38.84,23.72 35.1,23.72 34.77,24.05 34.77,29.57 v34.8,29.59
MOSI
  Top 0.152: J2.4 36.35,18.49 35.59,19.25 35.59,22.5 35.13,22.96 34.62,22.96 34.27,23.32 U1.15
N$2  (via drill 0.38)
  Top 0.203: U2.17 48.26,37.97 v48.26,39.37 | v49.53,29.21 49.17,29.57 49.17,30.02 49.73,30.58 51.02,30.58 D1.C
  Bottom 0.203: v48.26,39.37 48.26,39.78 48.69,40.21 54.13,40.21 54.48,39.85 54.48,29.69 54,29.21 v49.53,29.21
N$3
  Top 0.203: U2.10 52.06,30.58 D2.C
N$4
  Top 0.203: R3.1 50.55,27.96 51.03,28.45 D1.A
N$5
  Top 0.203: D2.A 52.05,28.25 52.35,27.94 52.35,27.19 R4.1
N$6
  Top 0.203: D3.A R6.1
N$7
  Top 0.152: U2.4 48.25,36.18 47.7,36.73 44.68,36.73 43.94,37.47 43.94,42.42 SJ1.1
N$8
  Top 0.203: U2.20 SJ2.1
N$9
  pour Top: 8.89,11.43 11.43,11.43 13.18,11.43 13.36,11.61 13.72,11.96 13.72,12.19 13.72,16 13.13,16.59 8.15,16.59 7.57,16 7.57,12.34 8.46,11.46 8.48,11.43
N$11
  Top 0.152: SJ3.1 15.93,48.13 14.81,49.25 14.81,52.07 15.99,53.25 X1.8
N$12
  Top 0.152: SJ4.1 18.54,48.59 17.32,49.81 17.32,52.56 X1.10
RX  (via drill 0.35)
  Top 0.152: U1.30 32.26,38.18 31.73,38.71 v19.84,38.71 | v15.93,42.72 SJ3.2 | v40.77,45.41 46.18,45.41 46.35,45.24 SJ2.2
  Bottom 0.152: v19.84,38.71 16.41,38.71 15.93,39.19 v15.93,42.72 16.71,43.51 24.64,43.51 25.12,43.99 25.12,45.19 25.43,45.49 40.69,45.49 v40.77,45.41
SCK
  Top 0.203: U1.17 36.4,32.54 36.73,32.21 36.73,30.4 37.38,29.75 | 37.38,29.75 R6.2 | J2.3 36.83,29.21 37.38,29.75
TX
  Top 0.152: U1.31 31.77,37.54 31.22,38.1 19.33,38.1 18.54,38.89 SJ4.2 21.16,44.78 21.87,45.49 34.04,45.49 34.31,45.21 34.31,44.32 34.67,43.97 SJ1.2
VIN
  pour Top: 14.73,13.94 14.73,16.28 13.87,17.14 2.79,17.14 2.06,17.88 2.06,41.07 2.62,41.63 5.79,41.63 6.05,41.38 6.05,24.69 6.76,23.98 13.36,23.98 14.07,23.27 14.07,20.24 14.61,19.71 16.28,19.71 18.39,19.66 19.84,18.21 19.84,14.58 19.25,13.99 16.89,13.99 16.87,13.97

### Text on the board
tNames: RPi JUMPER | FTDI JUMPER | 12V | Personal Health Dashboard | October 2019 | LAT | CLK | DAT | GND | 12V DC